# EAGLE design Prototyping OTG Board (EAGLE 6.1)
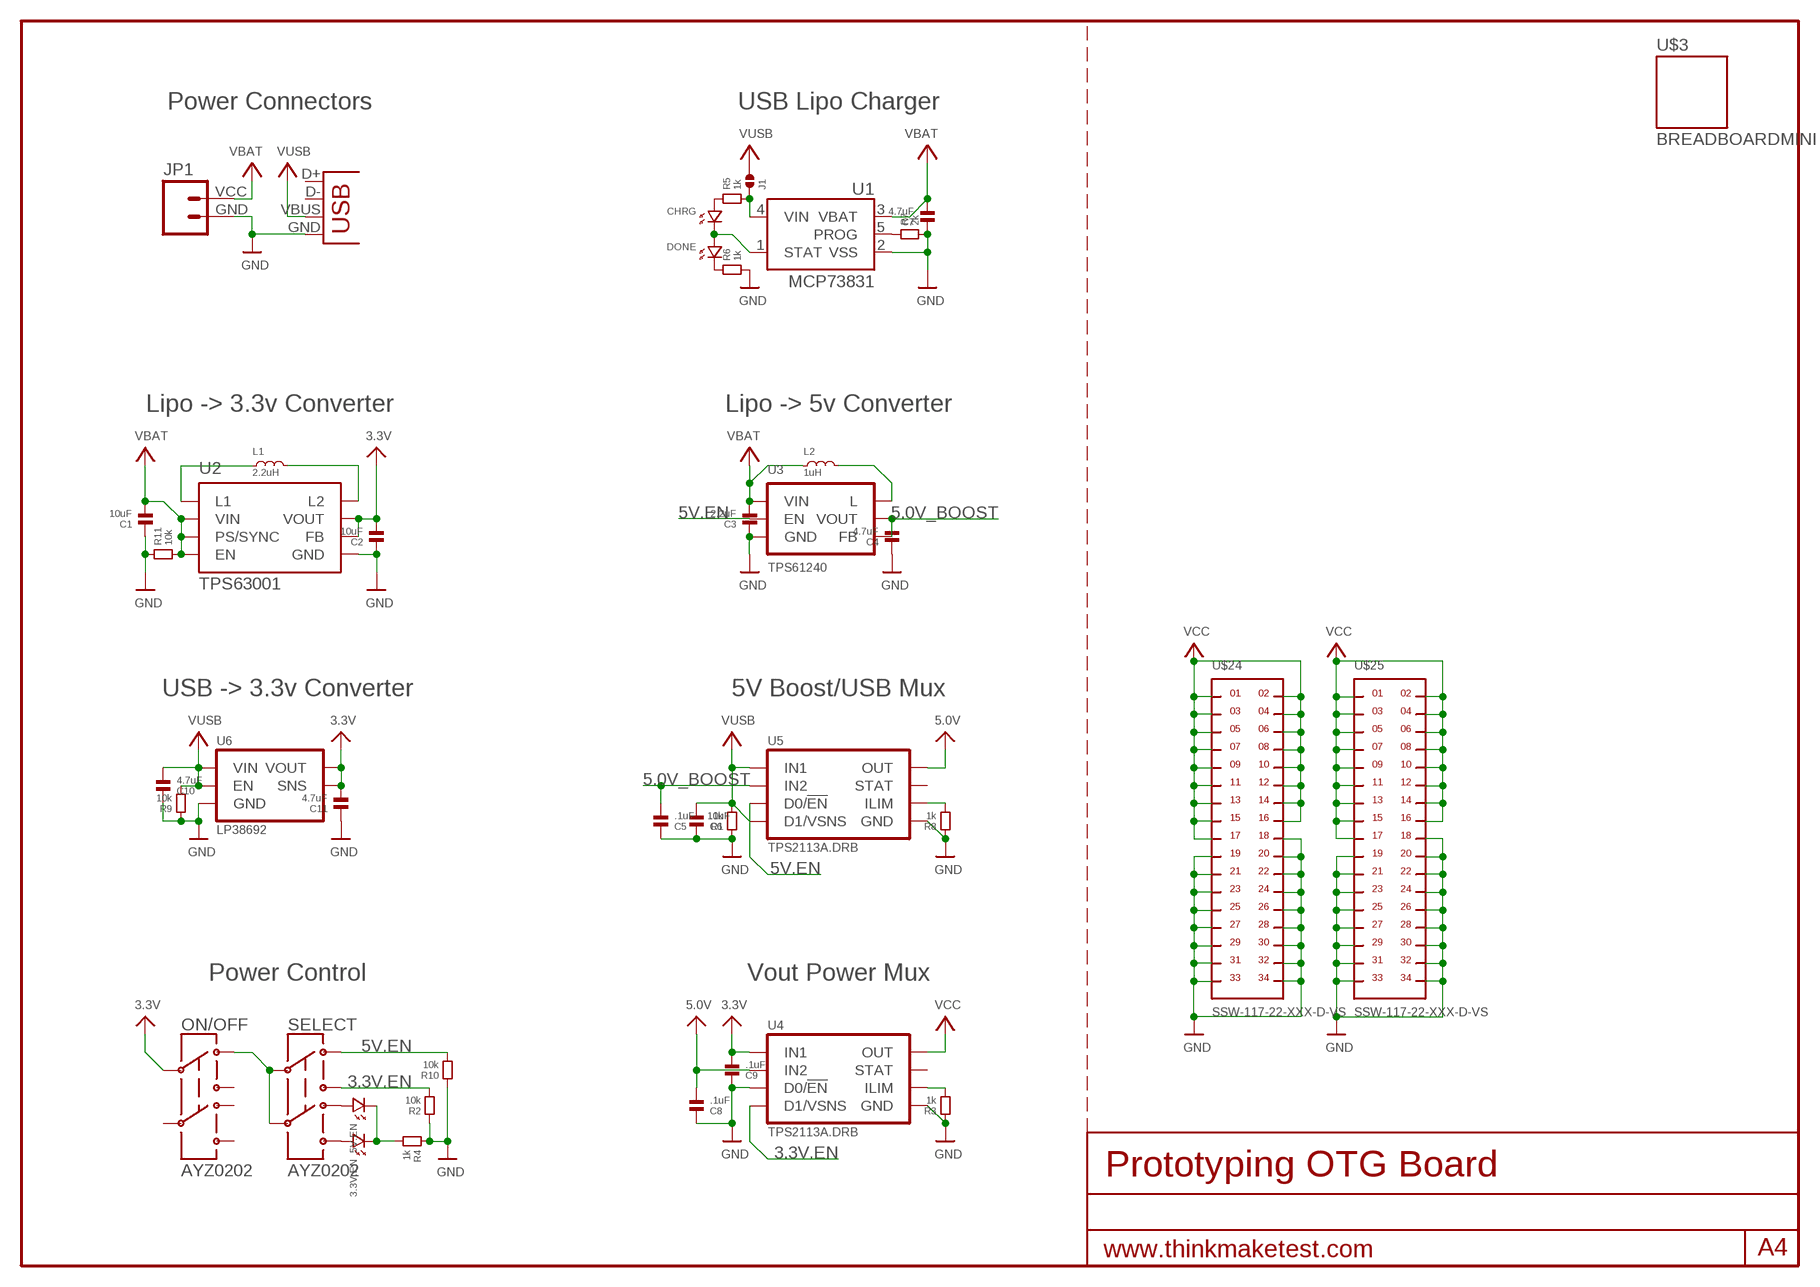
[diagram p0: schematic, sheet 1]

## Parts
3.3V.EN  LED.0603  [0603.LED]
5V.EN  LED.0603  [0603.LED]
C1  10uF  CAPACITOR.0603  [0603]
C2  10uF  CAPACITOR.0603  [0603]
C3  2.2uF  CAPACITOR.0603  [0603]
C4  4.7uF  CAPACITOR.0603  [0603]
C5  .1uF  CAPACITOR.0603  [0603]
C6  .1uF  CAPACITOR.0603  [0603]
C7  4.7uF  CAPACITOR.0603  [0603]
C8  .1uF  CAPACITOR.0603  [0603]
C9  .1uF  CAPACITOR.0603  [0603]
C10  4.7uF  CAPACITOR.0603  [0603]
C11  4.7uF  CAPACITOR.0603  [0603]
CHRG  LED.0603  [0603.LED]
DONE  LED.0603  [0603.LED]
J1  SOLDERJUMPER.2.LRG.PASTE  [2.LRG.PASTE]
JP1  M024UCON-15767  [JST-2-SMD-VERT]
L1  2.2uH  LQH3NPN___MM0  [LQH3NP_M0]
L2  1uH  MLP2016S1R0M  [0806.(2016)]
ON/OFF  AYZ0202  [AYZ0202]
R1  10k  RESISTOR.0603  [0603]
R2  10k  RESISTOR.0603  [0603]
R3  1k  RESISTOR.0603  [0603]
R4  1k  RESISTOR.0603  [0603]
R5  1k  RESISTOR.0603  [0603]
R6  1k  RESISTOR.0603  [0603]
R7  2k  RESISTOR.0603  [0603]
R8  1k  RESISTOR.0603  [0603]
R9  10k  RESISTOR.0603  [0603]
R10  10k  RESISTOR.0603  [0603]
R11  10k  RESISTOR.0603  [0603]
SELECT  AYZ0202  [AYZ0202]
U1  MCP73831  [SOT23-5]
U2  TPS63001  TPS6300  [DRC-S-PVSON-N10]
U3  TPS61240  [DRV]
U4  TPS2113A.DRB  TPS211XA.DRB  [DRB-S-PVSON-N8]
U5  TPS2113A.DRB  TPS211XA.DRB  [DRB-S-PVSON-N8]
U6  LP38692  [LLP6]
U$3  BREADBOARDMINI  [BREADBOARD-MINI]
U$24  SSW-117-22-XXX-D-VS  [SSW-117-22-XXX-D-VS]
U$25  SSW-117-22-XXX-D-VS  [SSW-117-22-XXX-D-VS]
X1  USBSMD  [USB-MINIB]

## Nets
3.3V: C2.2 C9.2 C11.2 ON/OFF.2 U2.1(VOUT) U2.10(FB) U4.8(IN1) U6.4(VOUT) U6.5(SNS)
3.3V.EN: R2.2 SELECT.1 U4.3(D1/VSNS)
5.0V: C8.2 U4.6(IN2) U5.7(OUT)
5.0V_BOOST: C4.2 C5.2 U3.2(VOUT) U3.3(FB) U5.6(IN2)
5V.EN: R10.2 SELECT.3 U3.4(EN) U5.2(D0/!EN)
GND: C1.1 C2.1 C3.1 C4.1 C5.1 C6.1 C7.1 C8.1 C9.1 C10.1 C11.1 JP1.GND R1.1 R2.1 R3.1 R4.1 R6.2 R7.2 R8.1 R9.1 R10.1 R11.1 U1.2(VSS) U2.3(GND) U2.9(GND) U2.TH(GND) U2.TH@1(GND) U2.TH@2(GND) U3.1(GND) U3.PAD(GND) U4.2(D0/!EN) U4.5(GND) U4.TH(GND) U4.TH@1(GND) U4.TH@2(GND) U5.5(GND) U5.TH(GND) U5.TH@1(GND) U5.TH@2(GND) U6.2(GND) U6.PAD(GND) U$24.18 U$24.19 U$24.20 U$24.21 U$24.22 U$24.23 U$24.24 U$24.25 U$24.26 U$24.27 U$24.28 U$24.29 U$24.30 U$24.31 U$24.32 U$24.33 U$24.34 U$25.18 U$25.19 U$25.20 U$25.21 U$25.22 U$25.23 U$25.24 U$25.25 U$25.26 U$25.27 U$25.28 U$25.29 U$25.30 U$25.31 U$25.32 U$25.33 U$25.34 X1.GND
N$1: R7.1 U1.5(PROG)
N$2: 5V.EN.P$1 SELECT.6
N$3: L1.1 U2.4(L1)
N$4: DONE.P$2 R6.1
N$5: CHRG.P$1 R5.1
N$6: CHRG.P$2 DONE.P$1 U1.1(STAT)
N$7: J1.1 R5.2 U1.4(VIN)
N$8: 3.3V.EN.P$1 SELECT.4
N$9: R3.2 U4.4(ILIM)
N$10: L1.2 U2.2(L2)
N$11: R8.2 U5.4(ILIM)
N$12: ON/OFF.3 SELECT.2 SELECT.5
N$14: 3.3V.EN.P$2 5V.EN.P$2 R4.2
N$15: L2.2 U3.5(L)
VBAT: C1.2 C3.2 C7.2 JP1.VCC L2.1 R11.2 U1.3(VBAT) U2.5(VIN) U2.6(EN) U2.7(PS/SYNC) U2.8(VIN) U3.6(VIN)
VCC: U4.7(OUT) U$24.1 U$24.2 U$24.3 U$24.4 U$24.5 U$24.6 U$24.7 U$24.8 U$24.9 U$24.10 U$24.11 U$24.12 U$24.13 U$24.14 U$24.15 U$24.16 U$24.17 U$25.1 U$25.2 U$25.3 U$25.4 U$25.5 U$25.6 U$25.7 U$25.8 U$25.9 U$25.10 U$25.11 U$25.12 U$25.13 U$25.14 U$25.15 U$25.16 U$25.17
VDD: C6.2 C10.2 J1.2 R1.2 R9.2 U5.3(D1/VSNS) U5.8(IN1) U6.1(VIN) U6.3(EN) U6.6(VIN) X1.VBUS ; supply symbol labelled VUSB
Unconnected: ON/OFF.1 ON/OFF.4 ON/OFF.5 ON/OFF.6 U4.1(STAT) U5.1(STAT) X1.D+ X1.D-

## Notes on the sheet
- Power Connectors | USB Lipo Charger
- Lipo -> 3.3v Converter | Lipo -> 5v Converter
- USB -> 3.3v Converter | 5V Boost/USB Mux
- Power Control | Vout Power Mux

## Library data of the parts
3.3V.EN 5V.EN CHRG DONE = .standardparts:LED
C1-C11 = .standardparts:CAPACITOR
J1 = .solderjumper:SOLDERJUMPER.2
JP1 = SparkFun:M02: Header 2 Standard 2-pin 0.1" header. Use with straight break away headers (SKU : PRT-00116), right angle break away headers (PRT-00553), swiss pins (PRT-00743), machine pins (PRT-00117), and female headers (PRT-00115). Molex polarized connector foot print use with SKU : PRT-08233 with associated crimp pins and housings.
L1 = murata:LQH3NPN___MM0
L2 = tdk:MLP2016S1R0M
ON/OFF SELECT = SparkFun:AYZ0202: SPDT Slide Switch Simple SMD single-pull double-throw slide switch. Good for less than 350mA power switch, switching UARTs between devices, etc. Spark Fun Electronics SKU : COM-00597
R1-R11 = .standardparts:RESISTOR
U1 = SparkFun:MCP73831: Microchip's MCP73831 Miniature single cell, fully integrated Li-Ion, Li-polymer charge management controller http://ww1.microchip.com/downloads/en/DeviceDoc/21984a.pdf
U2 = texas:TPS6300*: HIGH EFFICIENT SINGLE INDUCTOR BUCK-BOOST CONVERTER WITH 1.8-A SWITCHES Source: http://focus.ti.com/lit/ds/symlink/tps63001.pdf
U3 = texas:TPS61240
U4 U5 = texas:TPS211XA
U6 = national-semiconductor:LP38692
U$3 = SparkFun:BREADBOARD: Breadboard Mini Self Adhesive This is the mechnical outline for the very small self adhesive breadboard from SparkFun Electronics. Good for very small proto areas. SKU : PRT-07916
U$24 U$25 = samtec:SSW-117-22-XXX-D-VS
X1 = SparkFun:USB: USB Connectors USB-B-PTH is fully proven SKU : PRT-00139 USB-miniB is fully proven SKU : PRT-00587 USB-A-PCB is untested. USB-A-H is throughly reviewed, but untested. Spark Fun Electronics SKU : PRT-00437 USB-B-SMT is throughly reviewed, but untested. Needs silkscreen touching up. USB-A-S has not been used/tested USB-MB-H has not been used/tested

## Board
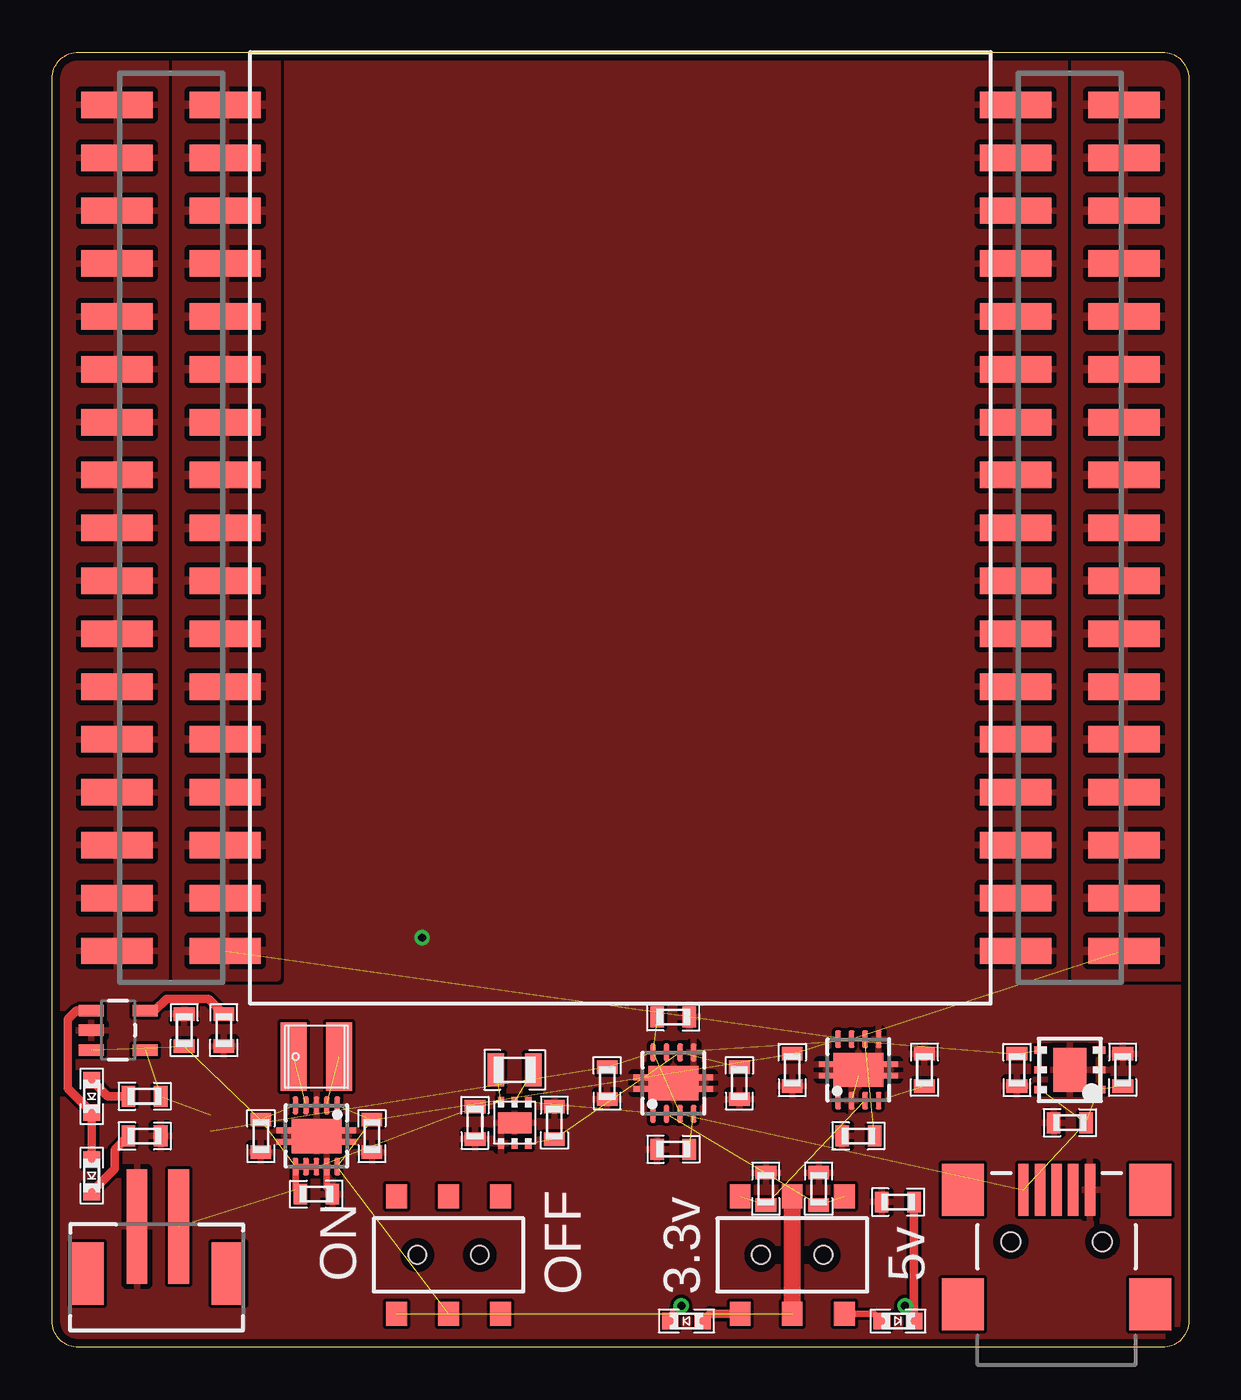
[diagram p1: board, top side]
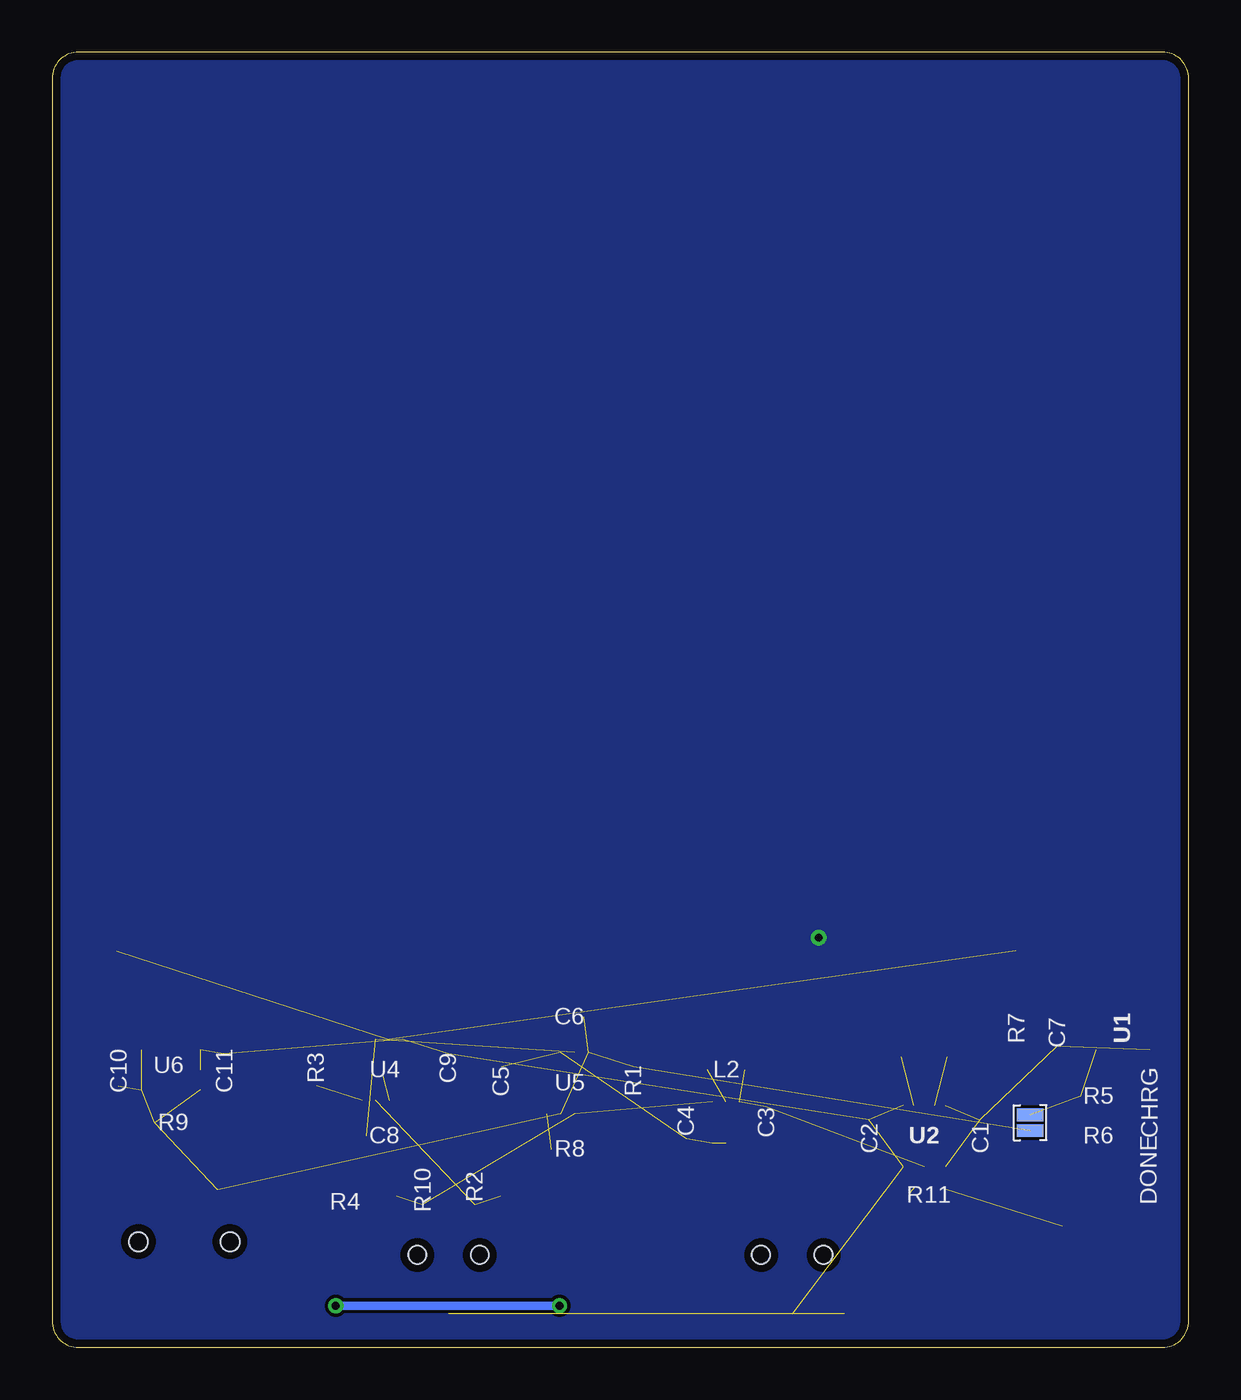
[diagram p2: board, bottom side, seen from below]

Size 54.61 x 62.23 mm. Coordinates in mm from the lower left corner, seen from the top.
Outline: 1.27,62.23 53.34,62.23 arc-90 54.61,60.96 54.61,1.27 arc-90 53.34,0 1.27,0 arc-90 0,1.27 0,60.96 arc-90 1.27,62.23
Copper layers (1*16): Top 0.0356mm / dielectric 1.5011mm / Bottom 0.0356mm
Design rules: minimum track width 6mil, minimum drill 13mil, track to track 6mil, track to pad 6mil, pad to pad 6mil, via to via 6mil, smd to smd 6mil, copper to edge 15mil, drill to drill 6mil, minimum pad ring 7mil, minimum via ring 7mil, stop-mask expansion 4mil, vias tented up to drill 0mil, thermal gap 10mil

### Footprints (pad centres in the part's own frame; a part is rotated, then mirrored left to right if it is on the bottom)
0603.LED = smd 0.8 x 0.8: P$1 -0.775,0; P$2 0.775,0
0603 = smd 0.65 x 1: 1 -0.775,0; 2 0.775,0
2.LRG.PASTE = smd 0.61 x 1.27: 1 -0.381,0; 2 0.381,0
JST-2-SMD-VERT = smd 1 x 5.5: GND 1,-2; VCC -1,-2 | smd 1.6 x 3: P$1 -3.4,0.27; P$2 3.4,0.27
LQH3NP_M0 = smd 1.25 x 3.3: 1 -1.1,0; 2 1.1,0
0806.(2016) = smd 0.8 x 1.6: 1 -0.9,0; 2 0.9,0
AYZ0202 = smd 1 x 1.15: 1 -2.5,2.825; 2 0,2.825; 3 2.5,2.825; 4 -2.5,-2.825; 5 0,-2.825; 6 2.5,-2.825 | hole 0.85: 1.5,0; -1.5,0
SOT23-5 = smd 0.55 x 1.2: 1 -0.95,-1.3; 2 0,-1.3; 3 0.95,-1.3; 4 0.95,1.3; 5 -0.95,1.3
DRC-S-PVSON-N10 = smd 0.28 x 0.85: 1 -1,-1.475; 2 -0.5,-1.475; 3 0,-1.475; 4 0.5,-1.475; 5 1,-1.475; 6 1,1.475; 7 0.5,1.475; 8 0,1.475; 9 -0.5,1.475; 10 -1,1.475 | smd 2.4 x 1.65: TH 0,0 | smd 3.8 x 0.28: TH@1 0,0.275; TH@2 0,-0.275
DRV = smd 0.3 x 0.5: 1 -0.65,-1; 2 0,-1; 3 0.65,-1; 4 0.65,1; 5 0,1; 6 -0.65,1 | smd 1.6 x 1: PAD 0,0
DRB-S-PVSON-N8 = smd 0.28 x 0.85: 1 -0.975,-1.475; 2 -0.325,-1.475; 3 0.325,-1.475; 4 0.975,-1.475; 5 0.975,1.475; 6 0.325,1.475; 7 -0.325,1.475; 8 -0.975,1.475 | smd 2.4 x 1.65: TH 0,0 | smd 3.8 x 0.28: TH@1 0,0.275; TH@2 0,-0.275
LLP6 = smd 0.35 x 0.6: 1 -0.95,-1.4; 2 0,-1.4; 3 0.95,-1.4; 4 0.95,1.4; 5 0,1.4; 6 -0.95,1.4 | smd 2.1 x 1.6: PAD 0,0
SSW-117-22-XXX-D-VS = smd 1.27 x 3.429: 1 -2.54,-2.603; 2 0,-2.603; 3 -5.08,-2.603; 4 2.54,-2.603; 5 -7.62,-2.603; 6 5.08,-2.603; 7 -10.16,-2.603; 8 7.62,-2.603; 9 -12.7,-2.603; 10 10.16,-2.603; 11 -15.24,-2.603; 12 12.7,-2.603; 13 -17.78,-2.603; 14 15.24,-2.603; 15 -20.32,-2.603; 16 17.78,-2.603; 17 20.32,-2.603; 18 2.54,2.603; 19 0,2.603; 20 5.08,2.603; 21 -2.54,2.603; 22 7.62,2.603; 23 -5.08,2.603; 24 10.16,2.603; 25 -7.62,2.603; 26 12.7,2.603; 27 -10.16,2.603; 28 15.24,2.603; 29 -12.7,2.603; 30 17.78,2.603; 31 -15.24,2.603; 32 20.32,2.603; 33 -17.78,2.603; 34 -20.32,2.603
USB-MINIB = smd 2.5 x 0.5: D+ 2.5,0; D- 2.5,0.8; GND 2.5,-1.6; ID 2.5,-0.8; VBUS 2.5,1.6 | smd 2.5 x 2: MTN1 -3,4.5; MTN2 2.5,4.5; MTN3 -3,-4.5; MTN4 2.5,-4.5 | hole 0.9: 0,2.2; 0,-2.2

### Placement (x,y rotation side)
3.3V.EN  30.48,1.27 180 top
5V.EN  40.64,1.27 0 top
C1  10.03,10.16 90 top
C2  15.37,10.16 90 top
C3  20.32,10.79 90 top
C4  24.13,10.79 270 top
C5  33.02,12.7 90 top
C6  29.84,15.88 180 top
C7  6.35,15.24 270 top
C8  38.73,10.16 0 top
C9  35.56,13.34 90 top
C10  51.44,13.34 270 top
C11  46.35,13.34 90 top
CHRG  1.91,12.06 270 top
DONE  1.91,8.26 270 top
J1  7.62,10.79 270 bottom
JP1  5.08,3.81 180 top
L1  12.7,13.97 0 top
L2  22.23,13.34 0 top
ON/OFF  19.05,4.45 180 top
R1  26.67,12.7 90 top
R2  34.29,7.62 270 top
R3  41.91,13.34 270 top
R4  40.64,6.99 0 top
R5  4.45,12.06 0 top
R6  4.45,10.16 0 top
R7  8.26,15.24 270 top
R8  29.84,9.53 0 top
R9  48.9,10.79 0 top
R10  36.83,7.62 270 top
R11  12.7,7.37 180 top
SELECT  35.56,4.45 0 top
U1  3.17,15.24 270 top
U2  12.7,10.16 180 top
U3  22.23,10.79 0 top
U4  38.73,13.34 0 top
U5  29.84,12.7 0 top
U6  48.9,13.34 90 top
U$3  45.09,16.51 90 top
U$24  5.71,39.37 90 top
U$25  48.9,39.37 90 top
X1  48.26,5.08 90 top

### Tracks (layer width: path | path; a pad name or v marks a point on that pad's centre or on a via)
3.3V  (8 unrouted)
3.3V.EN  (2 unrouted)
5.0V  (2 unrouted)
5.0V_BOOST  (4 unrouted)
5V.EN  (3 unrouted)
GND  (via drill 0.38)  (2 unrouted)
  Top 0.305: U2.9 13.2,7.64
  other vias: 17.78,19.68
  pour Bottom: 54.61,0 54.61,62.23 0,62.23 0,0
  pour Top (rank 6): 54.61,0 54.61,62.23 0,62.23 0,0
N$1
  Top 0.406: R7.1 7.52,16.75 5.5,16.75 4.94,16.19 U1.5
N$2
  Top 0.305: 5V.EN.P$1 39.52,1.62 SELECT.6
N$3  (1 unrouted)
N$4
  Top 0.406: R6.1 3,9.49 3,8.57 DONE.P$2
N$5
  Top 0.406: R5.1 2.68,12.06 CHRG.P$1
N$6
  Top 0.406: U1.1 1.19,16.19 0.75,15.75 0.75,12.45 CHRG.P$2 DONE.P$1
N$7  (2 unrouted)
N$8
  Top 0.406: 3.3V.EN.P$1 31.61,1.62 SELECT.4
N$9  (1 unrouted)
N$10  (1 unrouted)
N$11  (1 unrouted)
N$12  (1 unrouted)
  Top 0.813: SELECT.5 SELECT.2
N$14  (via drill 0.38)
  Top 0.406: 3.3V.EN.P$2 29.7,1.48 v30.23,2 | v40.98,2 41.41,1.56 5V.EN.P$2 R4.2
  Bottom 0.406: v30.23,2 v40.98,2
N$15  (1 unrouted)
VBAT  (8 unrouted)
  Top 0.305: U2.8 U2.7 U2.6 11.7,7.59 R11.2
VCC  (2 unrouted)
  pour Top (isolate 0.152): 49.15,17.78 49.15,62.23 54.61,62.23 54.61,17.78
  pour Top (isolate 0.152): 5.97,17.78 5.97,62.23 10.79,62.23 10.79,17.78
VDD  (10 unrouted)

### Text on the board
tPlace: ON | OFF | 3.3v | 5v
bDocu: CHRG Lipo